# Altium schematic sheet mounting_circuit(3).SchDoc
size A4; SheetNumber: 4; SheetTotal: 5
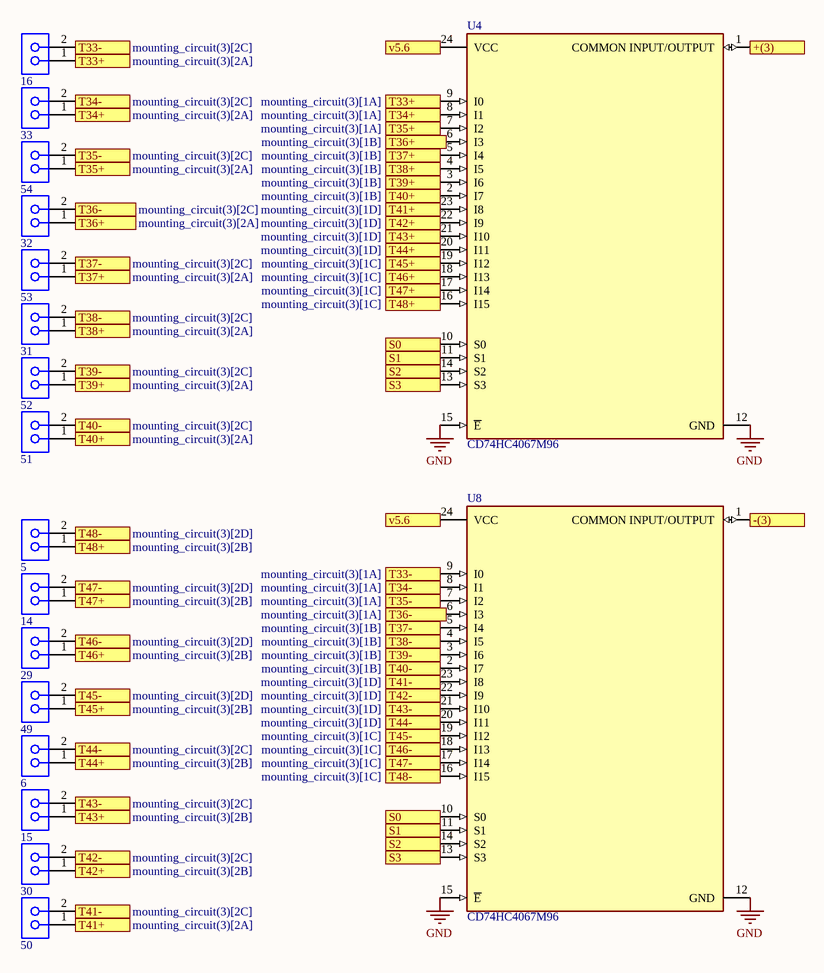
[diagram p0: mounting_circuit(3).SchDoc]

## Parts
5  Comment  [SMTC-SSW-102-02-X-S]  (value not drawn)
6  0  [SMTC-SSW-102-02-X-S]  (value not drawn)
14  Comment  [SMTC-SSW-102-02-X-S]  (value not drawn)
15  Comment  [SMTC-SSW-102-02-X-S]  (value not drawn)
16  Comment  [SMTC-SSW-102-02-X-S]  (value not drawn)
29  Comment  [SMTC-SSW-102-02-X-S]  (value not drawn)
30  Comment  [SMTC-SSW-102-02-X-S]  (value not drawn)
31  Comment  [SMTC-SSW-102-02-X-S]  (value not drawn)
32  Comment  [SMTC-SSW-102-02-X-S]  (value not drawn)
33  Comment  [SMTC-SSW-102-02-X-S]  (value not drawn)
49  0  [SMTC-SSW-102-02-X-S]  (value not drawn)
50  Comment  [SMTC-SSW-102-02-X-S]  (value not drawn)
51  1  [SMTC-SSW-102-02-X-S]  (value not drawn)
52  Comment  [SMTC-SSW-102-02-X-S]  (value not drawn)
53  Comment  [SMTC-SSW-102-02-X-S]  (value not drawn)
54  Comment  [SMTC-SSW-102-02-X-S]  (value not drawn)
U4  CD74HC4067M96  [FP-DW0024A-MFG]
U8  CD74HC4067M96  [FP-DW0024A-MFG]

## Ports
+(3), -(3), S0 (see mounting_circuit(2)[2B], mounting_circuit(2)[2D], mounting_circuit(3)[2B], mounting_circuit[3B], mounting_circuit[3D]), S0 (see mounting_circuit(2)[2B], mounting_circuit(2)[2D], mounting_circuit(3)[2D], mounting_circuit[3B], mounting_circuit[3D]), S1 (see mounting_circuit(2)[2B], mounting_circuit(2)[2D], mounting_circuit(3)[2B], mounting_circuit[3B], mounting_circuit[3D]), S1 (see mounting_circuit(2)[2B], mounting_circuit(2)[2D], mounting_circuit(3)[2D], mounting_circuit[3B], mounting_circuit[3D]), S2 (see mounting_circuit(2)[2B], mounting_circuit(2)[2D], mounting_circuit(3)[2B], mounting_circuit[3B], mounting_circuit[3D]), S2 (see mounting_circuit(2)[2B], mounting_circuit(2)[2D], mounting_circuit(3)[2D], mounting_circuit[3B], mounting_circuit[3D]), S3 (see mounting_circuit(2)[2B], mounting_circuit(2)[2D], mounting_circuit(3)[2B], mounting_circuit[3B], mounting_circuit[3D]), S3 (see mounting_circuit(2)[2B], mounting_circuit(2)[2D], mounting_circuit(3)[2D], mounting_circuit[3B], mounting_circuit[3D]), T33+ (see mounting_circuit(3)[1A]), T33+ (see mounting_circuit(3)[2A]), T33- (see mounting_circuit(3)[1A]), T33- (see mounting_circuit(3)[2C]), T34+ (see mounting_circuit(3)[1A]), T34+ (see mounting_circuit(3)[2A]), T34- (see mounting_circuit(3)[1A]), T34- (see mounting_circuit(3)[2C]), T35+ (see mounting_circuit(3)[1A]), T35+ (see mounting_circuit(3)[2A]), T35- (see mounting_circuit(3)[1A]), T35- (see mounting_circuit(3)[2C]), T36+ (see mounting_circuit(3)[1B]), T36+ (see mounting_circuit(3)[2A]), T36- (see mounting_circuit(3)[1A]), T36- (see mounting_circuit(3)[2C]), T37+ (see mounting_circuit(3)[1B]), T37+ (see mounting_circuit(3)[2A]), T37- (see mounting_circuit(3)[1B]), T37- (see mounting_circuit(3)[2C]), T38+ (see mounting_circuit(3)[1B]), T38+ (see mounting_circuit(3)[2A]), T38- (see mounting_circuit(3)[1B]), T38- (see mounting_circuit(3)[2C]), T39+ (see mounting_circuit(3)[1B]), T39+ (see mounting_circuit(3)[2A]), T39- (see mounting_circuit(3)[1B]), T39- (see mounting_circuit(3)[2C]), T40+ (see mounting_circuit(3)[1B]), T40+ (see mounting_circuit(3)[2A]), T40- (see mounting_circuit(3)[1B]), T40- (see mounting_circuit(3)[2C]), T41+ (see mounting_circuit(3)[1D]), T41+ (see mounting_circuit(3)[2A]), T41- (see mounting_circuit(3)[1D]), T41- (see mounting_circuit(3)[2C]), T42+ (see mounting_circuit(3)[1D]), T42+ (see mounting_circuit(3)[2B]), T42- (see mounting_circuit(3)[1D]), T42- (see mounting_circuit(3)[2C]), T43+ (see mounting_circuit(3)[1D]), T43+ (see mounting_circuit(3)[2B]), T43- (see mounting_circuit(3)[1D]), T43- (see mounting_circuit(3)[2C]), T44+ (see mounting_circuit(3)[1D]), T44+ (see mounting_circuit(3)[2B]), T44- (see mounting_circuit(3)[1D]), T44- (see mounting_circuit(3)[2C]), T45+ (see mounting_circuit(3)[1C]), T45+ (see mounting_circuit(3)[2B]), T45- (see mounting_circuit(3)[1C]), T45- (see mounting_circuit(3)[2D]), T46+ (see mounting_circuit(3)[1C]), T46+ (see mounting_circuit(3)[2B]), T46- (see mounting_circuit(3)[1C]), T46- (see mounting_circuit(3)[2D]), T47+ (see mounting_circuit(3)[1C]), T47+ (see mounting_circuit(3)[2B]), T47- (see mounting_circuit(3)[1C]), T47- (see mounting_circuit(3)[2D]), T48+ (see mounting_circuit(3)[1C]), T48+ (see mounting_circuit(3)[2B]), T48- (see mounting_circuit(3)[1C]), T48- (see mounting_circuit(3)[2D]), v5.6 (see mounting_circuit(2)[2A], mounting_circuit(2)[2C], mounting_circuit(3)[2A], mounting_circuit[1A], mounting_circuit[3A], mounting_circuit[3B]), v5.6 (see mounting_circuit(2)[2A], mounting_circuit(2)[2C], mounting_circuit(3)[2C], mounting_circuit[1A], mounting_circuit[3A], mounting_circuit[3B])

## Nets
GND: U4.12(GND) U4.15(~{E}) U8.12(GND) U8.15(~{E})
+(3): U4.1(COMMON_INPUT/OUTPUT) ; port +(3)
-(3): U8.1(COMMON_INPUT/OUTPUT) ; port -(3)
S0: U4.10(S0) U8.10(S0) ; port S0
S1: U4.11(S1) U8.11(S1) ; port S1
S2: U4.14(S2) U8.14(S2) ; port S2
S3: U4.13(S3) U8.13(S3) ; port S3
T33+: 16.1 U4.9(I0) ; port T33+
T33-: 16.2 U8.9(I0) ; port T33-
T34+: 33.1 U4.8(I1) ; port T34+
T34-: 33.2 U8.8(I1) ; port T34-
T35+: 54.1 U4.7(I2) ; port T35+
T35-: 54.2 U8.7(I2) ; port T35-
T36+: 32.1 ; port T36+
T36-: 32.2 ; port T36-
T37+: 53.1 U4.5(I4) ; port T37+
T37-: 53.2 U8.5(I4) ; port T37-
T38+: 31.1 U4.4(I5) ; port T38+
T38-: 31.2 U8.4(I5) ; port T38-
T39+: 52.1 U4.3(I6) ; port T39+
T39-: 52.2 U8.3(I6) ; port T39-
T40+: 51.1 U4.2(I7) ; port T40+
T40-: 51.2 U8.2(I7) ; port T40-
T41+: 50.1 U4.23(I8) ; port T41+
T41-: 50.2 U8.23(I8) ; port T41-
T42+: 30.1 U4.22(I9) ; port T42+
T42-: 30.2 U8.22(I9) ; port T42-
T43+: 15.1 U4.21(I10) ; port T43+
T43-: 15.2 U8.21(I10) ; port T43-
T44+: 6.1 U4.20(I11) ; port T44+
T44-: 6.2 U8.20(I11) ; port T44-
T45+: 49.1 U4.19(I12) ; port T45+
T45-: 49.2 U8.19(I12) ; port T45-
T46+: 29.1 U4.18(I13) ; port T46+
T46-: 29.2 U8.18(I13) ; port T46-
T47+: 14.1 U4.17(I14) ; port T47+
T47-: 14.2 U8.17(I14) ; port T47-
T48+: 5.1 U4.16(I15) ; port T48+
T48-: 5.2 U8.16(I15) ; port T48-
v5.6: U4.24(VCC) U8.24(VCC) ; port v5.6

Not connected (* = marked no-connect by the designer): U4 6(I3); U8 6(I3)

## Library data of the parts
5 6 14-16 29-33 49-54 = CMP-1023-00323-1: SQ Post Socket, Through-hole, Vertical, -55 to 105 degC, 2.54 mm Pitch, 2-Pin, Female, RoHS; Manufacturer: Samtec; PartNumber: SSW-102-02-T-S; Pitch: 2.54 mm; ComponentLink3Description: Package Specification; ComponentLink2Description: Datasheet; ComponentLink1Description: Manufacturer URL; PackageVersion: CA, 6/1987; DatasheetVersion: F-214; PackageDescription: Assembly, Socket Strip .016 X .031 Tail; ComponentLink2URL: http://www.samtec.com/documents/webfiles/pdf/SSW_TH.PDF; RoHS: True; ComponentLink3URL: http://www.samtec.com/documents/webfiles/cpdf/SSW-1XX-XX-XXX-X-XX-XXX-XX-MKT.pdf; ComponentLink1URL: http://www.samtec.com; PackageReference: SSW-102-02-X-S; Mounting Technology: Through-hole; Orientation: Vertical; Temperature Range: -55 to 105 degC
U4 U8 = CMP-04901-000007-1: IC MUX/DEMUX 1X16 24SOIC; Manufacturer: Texas Instruments; Standoff Height: 0.1mm; Logic Function Desc: Non-Inverting; Max Supply Voltage: 6V; Number Of Inputs: 16; Quiescent Current: 8uA; Number Of Circuits: 1; Propagation Delay: 6ns; Max Junction Temp: +150°C; Min Supply Voltage: 2V; ComponentLink2Description: Datasheet; Octopart: https://octopart.com/cd74hc4067m96-texas+instruments-722802; Ambient Temperature Range High: +125°C; Ipc Land Pattern Name: SOIC127P1030X265-24; Height: 2.65mm; Mouser Description: Multiplexer Switch ICs Hi-Spd CMOS 16Ch Anl Mltplxr/Demltplxr; Temperature Range Low: -55°C; Package: DW0024A; Temperature Range High: +125°C; Lead Free: Yes; ComponentLink2URL: http://www.ti.com/lit/ds/symlink/cd74hc4067.pdf; Manufacturer Part Number: CD74HC4067M96; RoHS: TRUE; Automotive: No; Device Class L1: Integrated Circuits (ICs); Digikey Description: IC MUX/DEMUX 1X16 24SOIC; Device Class L2: Logic ICs; Temperature: -55°C to +125°C; Device Class L3: Multiplexers; Category: IC; Ambient Temperature Range Low: -55°C; Number Of Outputs: 1